# Altium schematic sheet INDEX.SchDoc: INDEX
size 420 x 297 mm; Date: March 14; CheckedBy: ThS. Bùi Quốc Bảo; DrawnBy: Nguyễn Gia Huy; Revision: V1.0; SheetNumber: 2; SheetTotal: 11; MasterProject: STM32 DEMO PCB; Sub-system: DA1_prj.PrjPcb
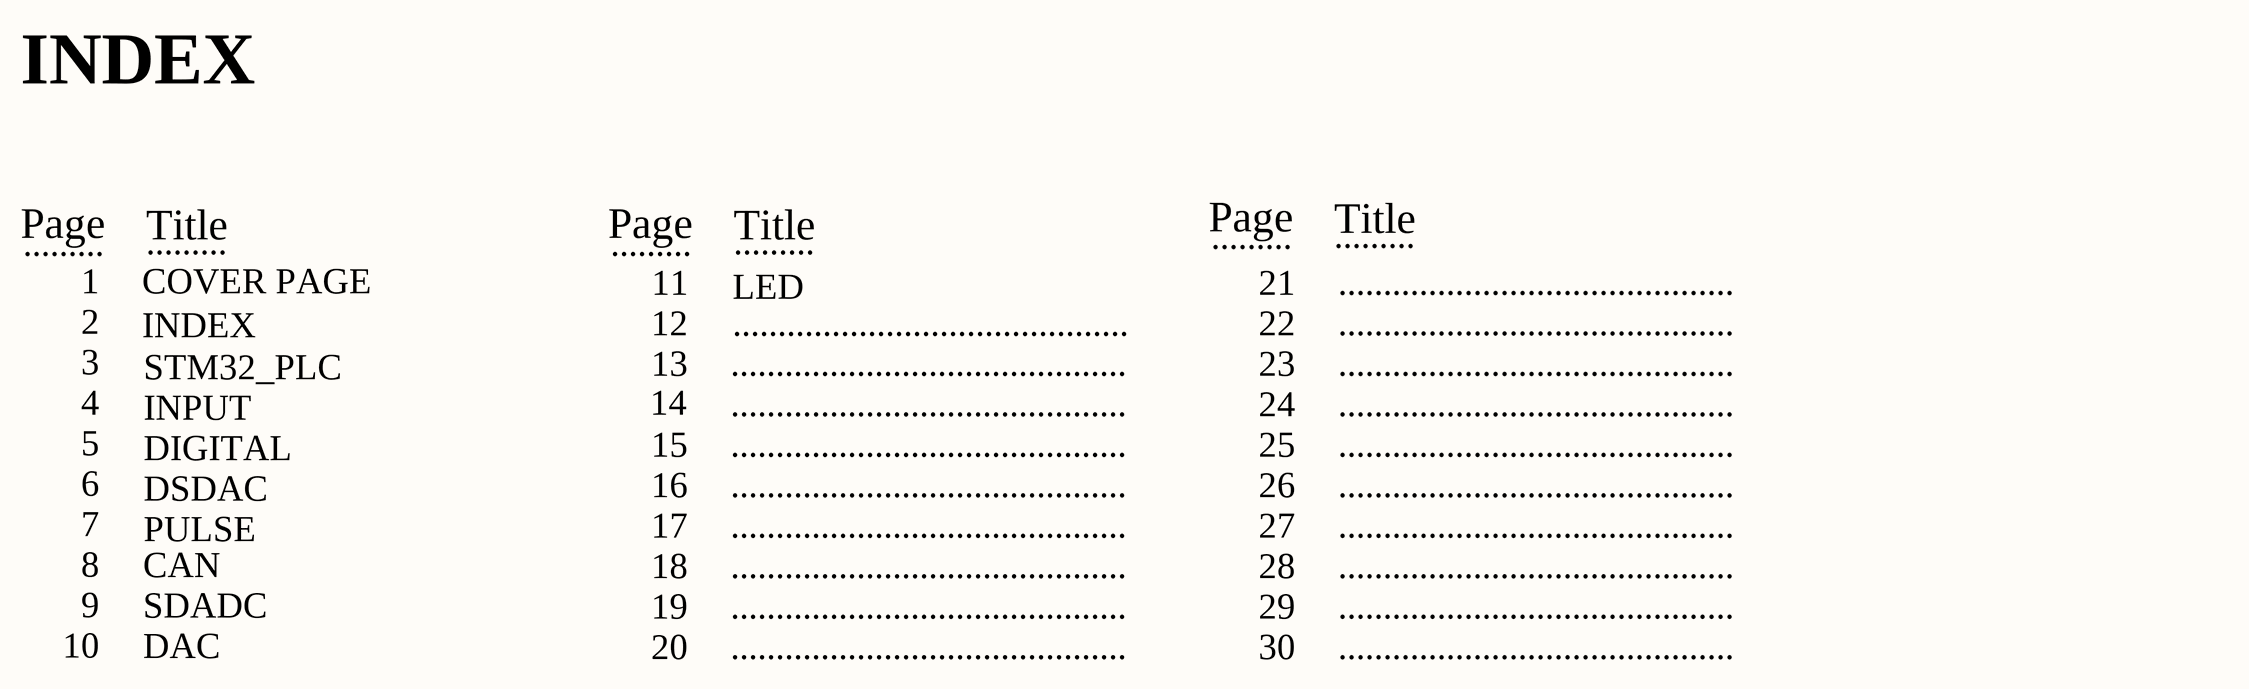
[diagram p0: INDEX.SchDoc]

## Notes on the sheet
- INDEX
- Page
- .........
- Title
- 1
- COVER PAGE
- 11
- LED
- 21
- ............................................
- 2
- 3
- STM32_PLC
- 12
- 13
- 22
- 23
- 4
- 5
- INPUT
- DIGITAL
- 14
- 15
- 24
- 25
- 6
- DSDAC
- 16
- 26
- 7
- 8
- CAN
- PULSE
- 17
- 18
- 27
- 28
- 9
- 10
- SDADC
- DAC
- 19
- 20
- 29
- 30
- Sub-system:
- Project:
- Design by:
- Sheet title:
- Sheet
- of
- Checked by:
- Approved by:
- Doc No:
- Revision:
- Size:
- Dates:
- A3